# EAGLE schematic imas_cjmcu_hx711_ads1232_ads1220 (EAGLE 9.6.2)
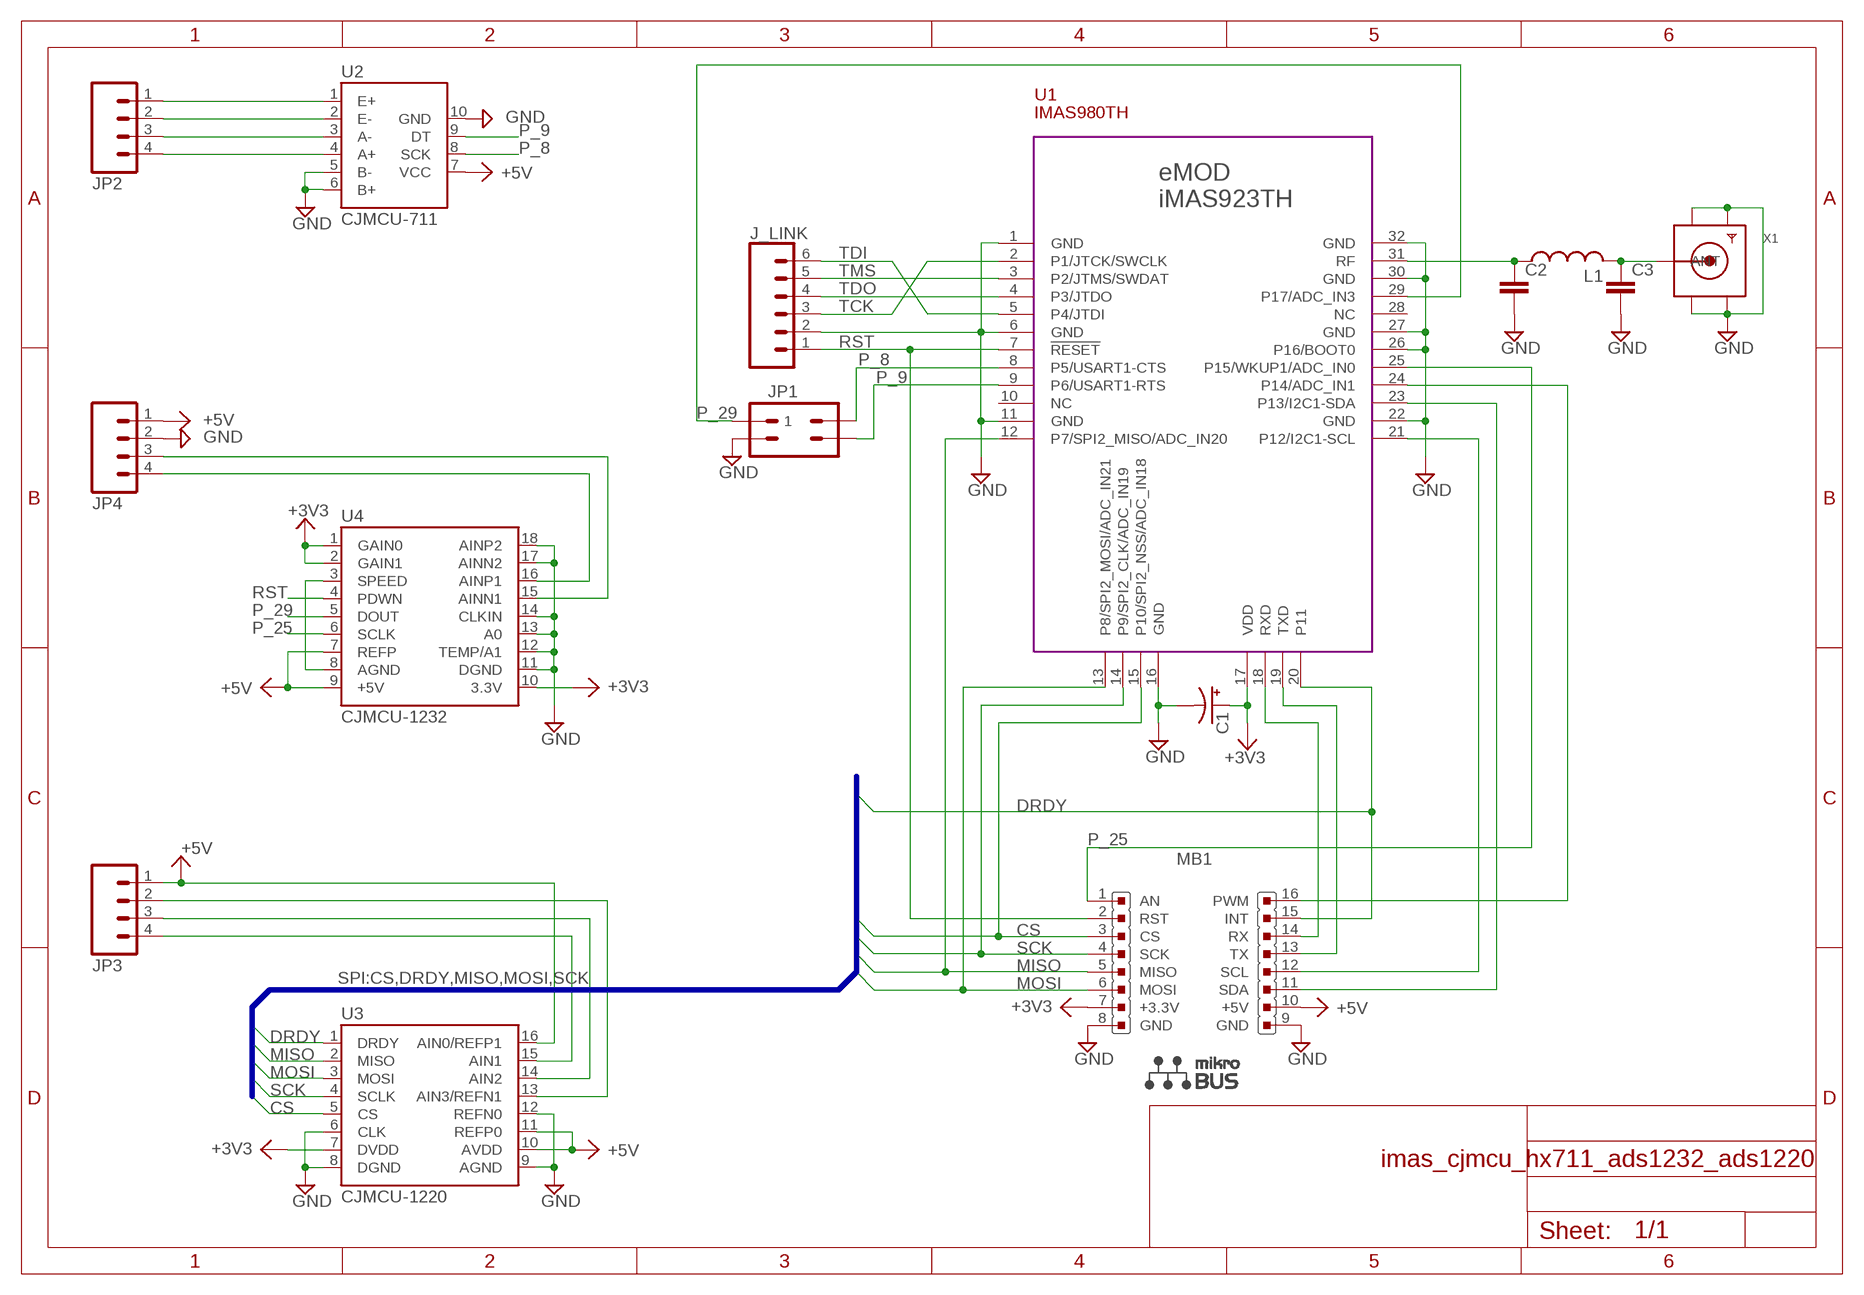
[diagram p0: schematic, sheet 1]

## Parts
C1  RCL_CPOL-US085CS-1AW  [RCL_085CS_1AW]
C2  RCL_C-EUC1206  [RCL_C1206]
C3  RCL_C-EUC1206  [RCL_C1206]
J_LINK  CONN_06SILK_FEMALE_PTH  [1X06]
JP1  M02X2  [2X02]
JP2  M04PTH  [1X04]
JP3  M04PTH  [1X04]
JP4  M04PTH  [1X04]
L1  L-USL1812  [L1812]
MB1  MIKROBUS  [MIKROBUS]
U1  IMAS980TH  [IMAS923TH]
U2  CJMCU-711  [CJMCU-711]
U3  CJMCU-1220  [CJMCU-1220]
U4  CJMCU-1232  [CJMCU-1232]
X1  SMACONNECTOR_EDGE_UFL  [SMA_EDGELAUNCH_UFL]

## Nets
+3V3: C1.+ MB1.7(+3.3V) U1.17(VDD) U3.7(DVDD) U4.1(GAIN0) U4.2(GAIN1) U4.10(3.3V)
+5V: JP3.1 JP4.1 MB1.10(+5V) U2.7(VCC) U3.10(AVDD) U3.11(REFP0) U3.16(AIN0/REFP1) U4.7(REFP) U4.9(+5V)
CS: MB1.3(CS) U1.15(P10/SPI2_NSS/ADC_IN18) U3.5(CS)
DRDY: MB1.15(INT) U1.20(P11) U3.1(DRDY)
GND: C1.- C2.2 C3.2 J_LINK.2 JP1.3 JP4.2 MB1.8(GND) MB1.9(GND) U1.1(GND) U1.6(GND) U1.11(GND) U1.16(GND) U1.22(GND) U1.26(P16/BOOT0) U1.27(GND) U1.30(GND) U1.32(GND) U2.5(B-) U2.6(B+) U2.10(GND) U3.6(CLK) U3.8(DGND) U3.9(AGND) U3.12(REFN0) U4.11(DGND) U4.12(TEMP/A1) U4.13(A0) U4.14(CLKIN) U4.17(AINN2) U4.18(AINP2) X1.GND@1(GND1) X1.GND@2(GND2) X1.GND@3(GND3) X1.GND@4(GND4)
MISO: MB1.5(MISO) U1.12(P7/SPI2_MISO/ADC_IN20) U3.2(MISO)
MOSI: MB1.6(MOSI) U1.13(P8/SPI2_MOSI/ADC_IN21) U3.3(MOSI)
N$2: U4.3(SPEED) U4.8(AGND)
N$3: JP4.4 U4.16(AINP1)
N$4: JP4.3 U4.15(AINN1)
N$6: MB1.14(RX) U1.18(RXD)
N$7: MB1.13(TX) U1.19(TXD)
N$9: MB1.16(PWM) U1.24(P14/ADC_IN1)
N$10: MB1.11(SDA) U1.23(P13/I2C1-SDA)
N$11: MB1.12(SCL) U1.21(P12/I2C1-SCL)
N$12: C2.1 L1.1 U1.31(RF)
N$13: C3.1 L1.2 X1.P(ANT)
N$14: JP2.1 U2.1(E+)
N$15: JP2.2 U2.2(E-)
N$16: JP2.3 U2.3(A-)
N$17: JP2.4 U2.4(A+)
N$24: JP3.2 JP3.3 JP3.4 U3.13(AIN3/REFN1) U3.14(AIN2) U3.15(AIN1)
P_8: JP1.2 U1.8(P5/USART1-CTS) U2.8(SCK)
P_9: JP1.4 U1.9(P6/USART1-RTS) U2.9(DT)
P_25: MB1.1(AN) U1.25(P15/WKUP1/ADC_IN0) U4.6(SCLK)
P_29: JP1.1 U1.29(P17/ADC_IN3) U4.5(DOUT)
RST: J_LINK.1 MB1.2(RST) U1.7(!RESET) U4.4(PDWN)
SCK: MB1.4(SCK) U1.14(P9/SPI2_CLK/ADC_IN19) U3.4(SCLK)
TCK: J_LINK.3 U1.2(P1/JTCK/SWCLK)
TDI: J_LINK.6 U1.5(P4/JTDI)
TDO: J_LINK.4 U1.4(P3/JTDO)
TMS: J_LINK.5 U1.3(P2/JTMS/SWDAT)
Unconnected: U1.10(NC) U1.28(NC)

## Buses
SPI:CS,DRDY,MISO,MOSI,SCK

## Library data of the parts
C1 = ipas:RCL_CPOL-US: POLARIZED CAPACITOR, American symbol
C2 C3 = ipas:RCL_C-EU: CAPACITOR, European symbol
J_LINK = SparkFun-Connectors:CONN_06: Multi connection point. Often used as Generic Header-pin footprint for 0.1 inch spaced/style header connections On any of the 0.1 inch spaced packages, you can populate with these: Break Away Headers - Straight <https://www.sparkfun.com/products/116> (PRT-00116) Break Away Male Headers - Right Angle <https://www.sparkfun.com/products/553> (PRT-00553) Female Headers <https://www.sparkfun.com/products/115> (PRT-00115) Break Away Headers - Machine Pin <https://www.sparkfun.com/products/117> (PRT-00117) Break Away Female Headers - Swiss Machine Pin <https://www.sparkfun.com/products/743> (PRT-00743) Arduino Stackable Header - 6 Pin <https://www.sparkfun.com/products/9280> (PRT-09280) For SCREWTERMINALS and SPRING TERMINALS visit here: Screw Terimnals on SparkFun.com <https://www.sparkfun.com/search/results?term=Screw+Terminals> (5mm/3.5mm/2.54mm spacing) This device is also useful as a general connection point to wire up your design to another part of your project. Our various solder wires solder well into these plated through hole pads. Hook-Up Wire - Assortment (Stranded, 22 AWG) <https://www.sparkfun.com/products/11375> (PRT-11375) Hook-Up Wire - Assortment (Solid Core, 22 AWG) <https://www.sparkfun.com/products/11367> (PRT-11367) View the entire wire category on our website here <https://www.sparkfun.com/categories/141>; PROD_ID: CONN-08437
JP1 = ipas:M02X2: Header 2 Standard 2-pin 0.1" header. Use with straight break away headers (SKU : PRT-00116), right angle break away headers (PRT-00553), swiss pins (PRT-00743), machine pins (PRT-00117), and female headers (PRT-00115). Molex polarized connector foot print use with SKU : PRT-08233 with associated crimp pins and housings.
JP2-JP4 = ipas:M04: Header 4 Standard 4-pin 0.1" header. Use with straight break away headers (SKU : PRT-00116), right angle break away headers (PRT-00553), swiss pins (PRT-00743), machine pins (PRT-00117), and female headers (PRT-00115). Molex polarized connector foot print use with SKU : PRT-08231 with associated crimp pins and housings. 1MM SMD Version SKU: PRT-10208
L1 = ipas:L-US: INDUCTOR, American symbol
MB1 = MikroBUS:MIKROBUS: MikroBUS Source: MikroBUS specification <http://www.mikroe.com/downloads/get/1737/mikrobus_specification.pdf> MikroBUS <http://www.mikroe.com/mikrobus/>
U1 = IMAS923TH:IMAS980TH: eMOD iMAS923TH EmOne (Thailand) Co.,Ltd. 39/1 Soi. Sangkhom Songkhro 12 Lat Phrao, Bangkok 10230 Thailand Eable library Created by EmOne @ 2018
U2 = ipas:CJMCU-711: CJMCU-711 HX711 module
U3 = ipas:CJMCU-1220: CJMCU-1220 ADS1220 module
U4 = ipas:CJMCU-1232: CJMCU-1220 ADS1220 module
X1 = adafruit:SMACONNECTOR: SMA Connector 90° DIP SMA Connector, 50 Ohm (4UConnector: 07259)